# Altium project Audio_Research.PrjPcb (part 3 of 4)

## Sheet Audio_Output_XLR2.SchDoc: Audio Out: Mini XLR 2
size 279 x 215 mm; DrawnBy: Connor Dack; Engineer: Connor Dack; DocumentNumber: 20; Revision: 1.0; SheetNumber: 20; SheetTotal: 20
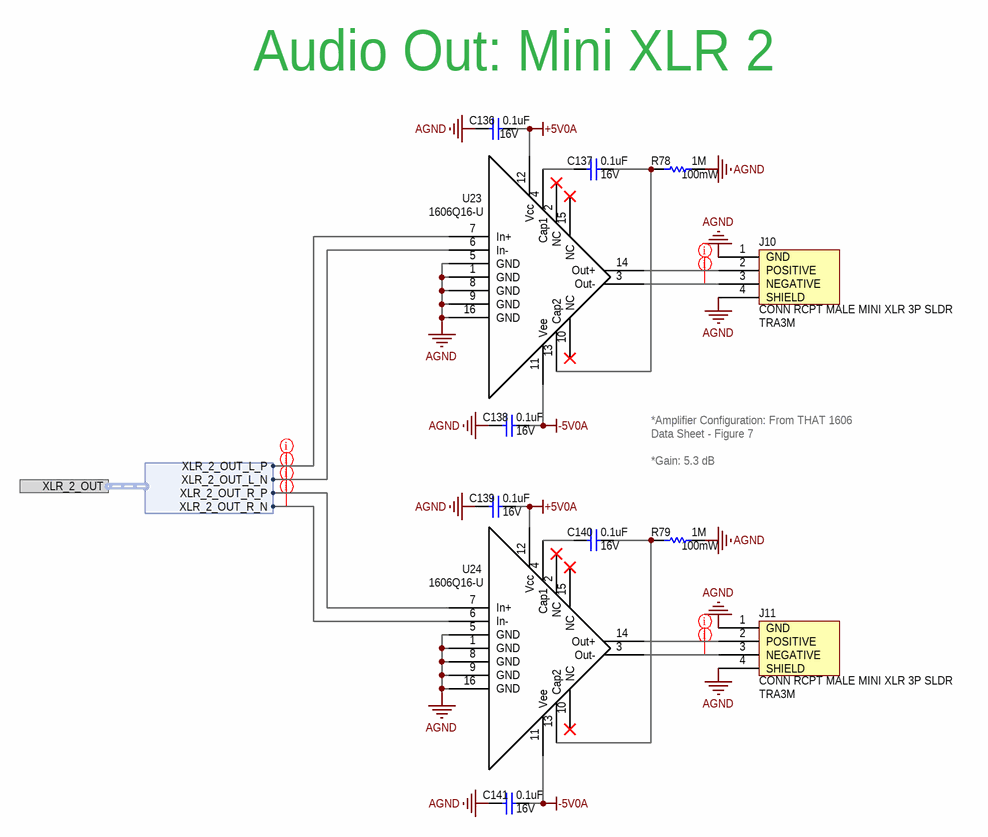
[diagram p8: Audio_Output_XLR2.SchDoc]

### Parts
C136  Voltage Rating: 16V  Capacitance: 0.1uF  [3-0603_L]  (hidden comment: CL10F104ZO8NNNC)
C137  Voltage Rating: 16V  Capacitance: 0.1uF  [3-0603_L]  (hidden comment: CL10F104ZO8NNNC)
C138  Voltage Rating: 16V  Capacitance: 0.1uF  [3-0603_L]  (hidden comment: CL10F104ZO8NNNC)
C139  Voltage Rating: 16V  Capacitance: 0.1uF  [3-0603_L]  (hidden comment: CL10F104ZO8NNNC)
C140  Voltage Rating: 16V  Capacitance: 0.1uF  [3-0603_L]  (hidden comment: CL10F104ZO8NNNC)
C141  Voltage Rating: 16V  Capacitance: 0.1uF  [3-0603_L]  (hidden comment: CL10F104ZO8NNNC)
J10  CONN RCPT MALE MINI XLR 3P SLDR  [TRA3M]
J11  CONN RCPT MALE MINI XLR 3P SLDR  [TRA3M]
R78  Max Power Dissipation: 100mW  Resistance: 1M  [3-0603_R_L]  (hidden comment: RMCF0603FG1M00)
R79  Max Power Dissipation: 100mW  Resistance: 1M  [3-0603_R_L]  (hidden comment: RMCF0603FG1M00)
U23  1606Q16-U  [SOP64P600X175-16N]
U24  1606Q16-U  [SOP64P600X175-16N]

### Ports
XLR_2_OUT (harness XLR_2_OUT)

### Harnesses
XLR_2_OUT: XLR_2_OUT_L_N, XLR_2_OUT_L_P, XLR_2_OUT_R_N, XLR_2_OUT_R_P

### Nets
+5V0A: C136.1 C139.1 U23.12(Vcc) U24.12(Vcc)
-5V0A: C138.1 C141.1 U23.11(Vee) U24.11(Vee)
AGND: C136.2 C138.2 C139.2 C141.2 J10.1(GND) J10.4(SHIELD) J11.1(GND) J11.4(SHIELD) R78.2 R79.2 U23.1(GND) U23.5(GND) U23.8(GND) U23.9(GND) U23.16(GND) U24.1(GND) U24.5(GND) U24.8(GND) U24.9(GND) U24.16(GND)
NetC137_1: C137.1 R78.1 U23.13(Cap2)
NetC137_2: C137.2 U23.4(Cap1)
NetC140_1: C140.1 R79.1 U24.13(Cap2)
NetC140_2: C140.2 U24.4(Cap1)
NetJ10_2: J10.2(POSITIVE) U23.14(Out+)
NetJ10_3: J10.3(NEGATIVE) U23.3(Out-)
NetJ11_2: J11.2(POSITIVE) U24.14(Out+)
NetJ11_3: J11.3(NEGATIVE) U24.3(Out-)
NetU1_10: U23.7(In+) ; port XLR_2_OUT.XLR_2_OUT_L_P
NetU1_11: U23.6(In-) ; port XLR_2_OUT.XLR_2_OUT_L_N
NetU1_12: U24.7(In+) ; port XLR_2_OUT.XLR_2_OUT_R_P
NetU1_13: U24.6(In-) ; port XLR_2_OUT.XLR_2_OUT_R_N

Not connected (* = marked no-connect by the designer): U23 2(NC)* 10(NC)* 15(NC)*; U24 2(NC)* 10(NC)* 15(NC)*

### Layout directives
net class XLR_2_Out: NetU1_10, NetU1_11, NetU1_12, NetU1_13
net class XLR_2_Out_Conn: NetJ10_2, NetJ10_3, NetJ11_2, NetJ11_3

### Notes on the sheet
- (near C136) Audio Out: Mini XLR 2
- *Amplifier Configuration: From THAT 1606 Data Sheet - Figure 7
  *Gain: 5.3 dB
- Title:
- Sheet:
- of
- Size:
- 11 x 8.5 Inches
- Rev:
- Date:
- Engineer:
- Time:
- File:
- Copyright 2020 Audio Logic Inc
  THE HARDWARE IS PROVIDED "AS IS", WITHOUT WARRANTY OF ANY KIND, EXPRESS OR IMPLIED, INCLUDING BUT NOT LIMITED TO THE WARRANTIES OF MERCHANTABILITY, FITNESS FOR A PARTICULAR PURPOSE AND NONINFRINGEMENT. IN NO EVENT SHALL THE AUTHORS OR COPYRIGHT HOLDERS BE LIABLE FOR ANY CLAIM, DAMAGES OR OTHER LIABILITY, WHETHER IN AN ACTION OF CONTRACT, TORT OR OTHERWISE, ARISING FROM, OUT OF OR IN CONNECTION WITH THE HARDWARE OR THE USE OR OTHER DEALINGS IN THE HARDWARE.

### Library data of the parts
C136-C141 = CL10F104ZO8NNNC: as C3 on sheet Audio_Codec; Supplier 1: Digi-Key; Stock 1: 40000; Pricing 1: 1=0.1, 10=0.038, 100=0.0169, 500=0.01208, 1000=0.00949 (USD); Mount: Surface Mount; Case/Package: 0603; Case Code (Metric): 1608; Case Code (Imperial): 0603; Min Operating Temperature: -30°C; Max Operating Temperature: 85°C; Package Quantity: 1; Packaging: Tape and Reel; Dielectric: Y5V; Length: 1.6mm; Height: 0.8mm; Width: 0.031inch; Thickness: 0.035inch; Depth: 0.8mm; Radiation Hardening: No; ComponentLink1URL: https://datasheet.ciiva.com/25805/cl10f104zo8nnnc-25805810.pdf; ComponentLink1Description: https://datasheet.ciiva.com/25805/cl10f104zo8nnnc-25805810.pdf; ComponentLink2URL: https://datasheet.ciiva.com/16199/cl10f104zo8nnnc-16199254.pdf; ComponentLink2Description: https://datasheet.ciiva.com/16199/cl10f104zo8nnnc-16199254.pdf; Supplier Part Number 1: 1276-1258-6-ND; Manufacturer Part Number: CL10F104ZO8NNNC
J10 J11 = TRA3M: 3 Position Circular Connector Receptacle, Male Pins Solder Silver; Manufacturer: Switchcraft; Body Material: Metal,Copper Alloy; Max Current Rating: 5A; Max Voltage Rating (AC): 125V; Voltage Rating: 250V; Connector Type: Receptacle,Pin; Number of Positions: 3; Number of Ports: 1; Wire/Cable Gauge: 28AWG; Supplier 1: Digi-Key; Stock 1: 295; Pricing 1: 1=12.74, 10=9.754, 25=9.5096, 50=8.7782, 100=8.2906, 250=7.9248 (USD); Mount: Through Hole,Panel,Bulkhead,PCB; Case/Package: Metal; Contact Material: Brass,Copper Alloy; Contact Plating: Nickel,Tin,Silver; Colour: Black; Number of Terminals: 3; Housing Material: Copper Alloy; Insulation Material: Thermoplastic; Min Operating Temperature: -55°C; Max Operating Temperature: 85°C; Package Quantity: 1; Current Rating: 5A; Fastening Type: Threaded; Packaging: Bulk; Gender: Male; Termination: Solder; Number of Contacts: 3; Orientation: Right Angle; Length: 15.49mm; Height: 15.24mm; Depth: 26.92mm; REACH SVHC: No SVHC; Lead Free: Lead Free; ComponentLink1URL: https://datasheet.ciiva.com/7327/tra3m-series-cd-7327368.pdf; ComponentLink1Description: https://datasheet.ciiva.com/7327/tra3m-series-cd-7327368.pdf; ComponentLink2URL: https://datasheet.ciiva.com/16879/70214235-16879259.pdf; ComponentLink2Description: https://datasheet.ciiva.com/16879/70214235-16879259.pdf; ComponentLink3URL: https://datasheet.ciiva.com/8053/28686-8053836.pdf; ComponentLink3Description: https://datasheet.ciiva.com/8053/28686-8053836.pdf; Supplier Part Number 1: SC1550-ND; Manufacturer Part Number: TRA3M
R78 R79 = RMCF0603FG1M00: RES 1M OHM 1% 1/10W 0603; Manufacturer: Stackpole Electronics; Temperature Coefficient: 100ppm/°C; Supplier 1: Digi-Key; Manufacturer Part Number: RMCF0603FG1M00; Stock 1: 129722; Pricing 1: 1=0.1, 10=0.017, 100=0.0069, 1000=0.00309, 2500=0.00268, 5000=0.00222 (USD); Mount: Surface Mount; Case/Package: 0603; Case Code (Metric): 1608; Case Code (Imperial): 0603; Contact Plating: Tin,Matte; Min Operating Temperature: -55°C; Max Operating Temperature: 155°C; Package Quantity: 1; Packaging: Tape and Reel; Tolerance: 1%; Composition: Thick Film; Number of Terminations: 2; Length: 0.061inch; Height: 0.022inch; Width: 0.031inch; Radiation Hardening: No; Lead Free: Contains Lead; ComponentLink1URL: https://www.seielect.com/Catalog/SEI-RMCF_RMCP.pdf; ComponentLink1Description: https://www.seielect.com/Catalog/SEI-RMCF_RMCP.pdf; ComponentLink2URL: https://www.seielect.com/catalog/SEI-Packaging.pdf; ComponentLink2Description: https://www.seielect.com/catalog/SEI-Packaging.pdf; Supplier Part Number 1: RMCF0603FG1M00CT-ND
U23 U24 = 1606Q16-U: Audio Amplifiers Balanced Audio Line Driver IC; Manufacturer: THAT; Max Supply Voltage: 18V; Min Supply Voltage: 4V; Nominal Supply Current: 4.9mA; Supplier 1: Mouser; Stock 1: 3475; Pricing 1: 1=4.65, 10=4.65, 50=3.91, 100=3.35, 1000=2.79, 10000=2.6 (USD); Case/Package: QSOP; Min Operating Temperature: -40°C; Max Operating Temperature: 85°C; Package Quantity: 98; Packaging: Rail/Tube; ComponentLink1URL: http://www.mouser.com/ds/2/407/1600data-6754.pdf; ComponentLink1Description: http://www.mouser.com/ds/2/407/1600data-6754.pdf; Supplier Part Number 1: 887-1606Q16-U; Manufacturer Part Number: 1606Q16-U

## Sheet Audio_Input_Mic_In.SchDoc: Audio Input: Microphone In
size 279 x 215 mm; DrawnBy: Connor Dack; Engineer: Connor Dack; DocumentNumber: 13; Revision: 1.0; SheetNumber: 13; SheetTotal: 20
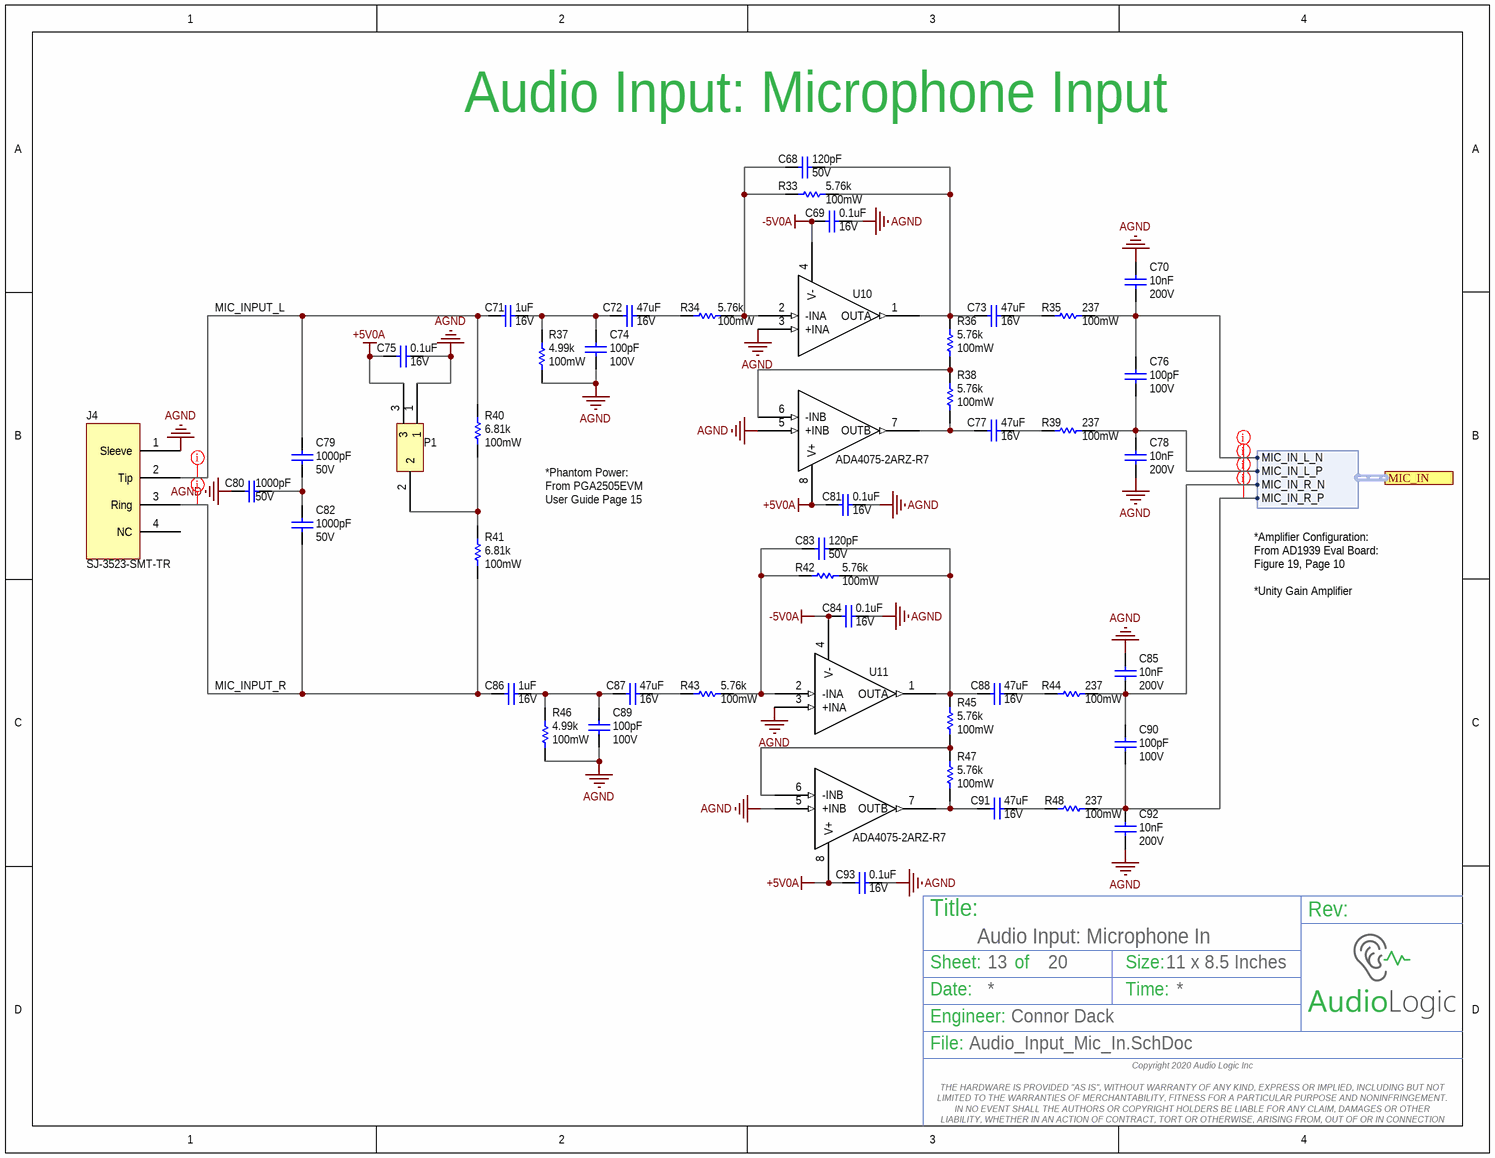
[diagram p9: Audio_Input_Mic_In.SchDoc]

### Parts
C68  Voltage - Rated: 50V  Capacitance: 120pF  [3-0603_L]  (hidden comment: CL10C121JB8NCNC)
C69  Voltage Rating: 16V  Capacitance: 0.1uF  [3-0603_L]  (hidden comment: CL10F104ZO8NNNC)
C70  Voltage Rating: 200V  Capacitance: 10nF  [3-0603_L]
C71  Voltage Rating: 16V  Capacitance: 1uF  [3-0603_L]  (hidden comment: CGA3E1X7R1C105M080AC)
C72  Voltage Rating: 16V  Capacitance: 47uF  [C1210X25_L]  (hidden comment: CL32A476KOJNNNE)
C73  Voltage Rating: 16V  Capacitance: 47uF  [C1210X25_L]  (hidden comment: CL32A476KOJNNNE)
C74  Voltage - Rated: 100V  Capacitance: 100pF  [3-0603_L]  (hidden comment: C1608C0G2A101J)
C75  Voltage Rating: 16V  Capacitance: 0.1uF  [3-0603_L]  (hidden comment: CL10F104ZO8NNNC)
C76  Voltage - Rated: 100V  Capacitance: 100pF  [3-0603_L]  (hidden comment: C1608C0G2A101J)
C77  Voltage Rating: 16V  Capacitance: 47uF  [C1210X25_L]  (hidden comment: CL32A476KOJNNNE)
C78  Voltage Rating: 200V  Capacitance: 10nF  [3-0603_L]
C79  Voltage - Rated: 50V  Capacitance: 1000pF  [3-0603_L]  (hidden comment: CL10B102KB8NNNC)
C80  Voltage - Rated: 50V  Capacitance: 1000pF  [3-0603_L]  (hidden comment: CL10B102KB8NNNC)
C81  Voltage Rating: 16V  Capacitance: 0.1uF  [3-0603_L]  (hidden comment: CL10F104ZO8NNNC)
C82  Voltage - Rated: 50V  Capacitance: 1000pF  [3-0603_L]  (hidden comment: CL10B102KB8NNNC)
C83  Voltage - Rated: 50V  Capacitance: 120pF  [3-0603_L]  (hidden comment: CL10C121JB8NCNC)
C84  Voltage Rating: 16V  Capacitance: 0.1uF  [3-0603_L]  (hidden comment: CL10F104ZO8NNNC)
C85  Voltage Rating (DC): 200V  Capacitance: 10nF  [3-0603_L]
C86  Voltage Rating: 16V  Capacitance: 1uF  [3-0603_L]  (hidden comment: CGA3E1X7R1C105M080AC)
C87  Voltage Rating: 16V  Capacitance: 47uF  [C1210X25_L]  (hidden comment: CL32A476KOJNNNE)
C88  Voltage Rating: 16V  Capacitance: 47uF  [C1210X25_L]  (hidden comment: CL32A476KOJNNNE)
C89  Voltage - Rated: 100V  Capacitance: 100pF  [3-0603_L]  (hidden comment: C1608C0G2A101J)
C90  Voltage - Rated: 100V  Capacitance: 100pF  [3-0603_L]  (hidden comment: C1608C0G2A101J)
C91  Voltage Rating: 16V  Capacitance: 47uF  [C1210X25_L]  (hidden comment: CL32A476KOJNNNE)
C92  Voltage Rating: 200V  Capacitance: 10nF  [3-0603_L]
C93  Voltage Rating: 16V  Capacitance: 0.1uF  [3-0603_L]  (hidden comment: CL10F104ZO8NNNC)
J4  SJ-3523-SMT-TR  [SJ-3523-SMT-TR]
P1  3PIN_Connector  [3Pin_Header]  (value not drawn)
R33  Power (Watts): 100mW  Resistance (Ohms): 5.76k  [3-0603_R_L]  (hidden comment: ERJ-3EKF5761V)
R34  Power (Watts): 100mW  Resistance (Ohms): 5.76k  [3-0603_R_L]  (hidden comment: ERJ-3EKF5761V)
R35  Power (Watts): 100mW  Resistance (Ohms): 237  [3-0603_R_L]  (hidden comment: ERJ-3EKF2370V)
R36  Power (Watts): 100mW  Resistance (Ohms): 5.76k  [3-0603_R_L]  (hidden comment: ERJ-3EKF5761V)
R37  Power (Watts): 100mW  Resistance (Ohms): 4.99k  [3-0603_R_L]  (hidden comment: ERJ-3EKF4991V)
R38  Power (Watts): 100mW  Resistance (Ohms): 5.76k  [3-0603_R_L]  (hidden comment: ERJ-3EKF5761V)
R39  Power (Watts): 100mW  Resistance (Ohms): 237  [3-0603_R_L]  (hidden comment: ERJ-3EKF2370V)
R40  Power Rating: 100mW  Resistance: 6.81k  [3-0603_R_L]  (hidden comment: ERJ-3EKF6811V)
R41  Power Rating: 100mW  Resistance: 6.81k  [3-0603_R_L]  (hidden comment: ERJ-3EKF6811V)
R42  Power (Watts): 100mW  Resistance (Ohms): 5.76k  [3-0603_R_L]  (hidden comment: ERJ-3EKF5761V)
R43  Power (Watts): 100mW  Resistance (Ohms): 5.76k  [3-0603_R_L]  (hidden comment: ERJ-3EKF5761V)
R44  Power (Watts): 100mW  Resistance (Ohms): 237  [3-0603_R_L]  (hidden comment: ERJ-3EKF2370V)
R45  Power (Watts): 100mW  Resistance (Ohms): 5.76k  [3-0603_R_L]  (hidden comment: ERJ-3EKF5761V)
R46  Power (Watts): 100mW  Resistance (Ohms): 4.99k  [3-0603_R_L]  (hidden comment: ERJ-3EKF4991V)
R47  Power (Watts): 100mW  Resistance (Ohms): 5.76k  [3-0603_R_L]  (hidden comment: ERJ-3EKF5761V)
R48  Power (Watts): 100mW  Resistance (Ohms): 237  [3-0603_R_L]  (hidden comment: ERJ-3EKF2370V)
U10  ADA4075-2ARZ-R7  [SOIC127P600X175-8L]
U11  ADA4075-2ARZ-R7  [SOIC127P600X175-8L]

### Ports
MIC_IN (harness MIC_IN)

### Harnesses
MIC_IN: MIC_IN_R_P, MIC_IN_R_N, MIC_IN_L_N, MIC_IN_L_P

### Nets
+5V0A: C75.2 C81.2 C93.2 P1.3 U10.8(V+) U11.8(V+)
-5V0A: C69.2 C84.2 U10.4(V-) U11.4(V-)
AGND: C69.1 C70.2 C74.2 C75.1 C78.1 C80.2 C81.1 C84.1 C85.2 C89.2 C92.1 C93.1 J4.1(Sleeve) P1.1 R37.1 R46.1 U10.3(+INA) U10.5(+INB) U11.3(+INA) U11.5(+INB)
MIC_INPUT_L: C71.1 C79.2 J4.2(Tip) R40.2
MIC_INPUT_R: C82.1 C86.1 J4.3(Ring) R41.1
NetC68_1: C68.1 R33.1 R34.2 U10.2(-INA)
NetC68_2: C68.2 C73.1 R33.2 R36.1 U10.1(OUTA)
NetC70_1: C70.1 C76.2 R35.2 ; port MIC_IN.MIC_IN_L_N
NetC71_2: C71.2 C72.1 C74.1 R37.2
NetC72_2: C72.2 R34.1
NetC73_2: C73.2 R35.1
NetC76_1: C76.1 C78.2 R39.2 ; port MIC_IN.MIC_IN_L_P
NetC77_1: C77.1 R38.2 U10.7(OUTB)
NetC77_2: C77.2 R39.1
NetC79_1: C79.1 C80.1 C82.2
NetC83_1: C83.1 R42.1 R43.2 U11.2(-INA)
NetC83_2: C83.2 C88.1 R42.2 R45.1 U11.1(OUTA)
NetC85_1: C85.1 C90.2 R44.2 ; port MIC_IN.MIC_IN_R_N
NetC86_2: C86.2 C87.1 C89.1 R46.2
NetC87_2: C87.2 R43.1
NetC88_2: C88.2 R44.1
NetC90_1: C90.1 C92.2 R48.2 ; port MIC_IN.MIC_IN_R_P
NetC91_1: C91.1 R47.2 U11.7(OUTB)
NetC91_2: C91.2 R48.1
NetP1_2: P1.2 R40.1 R41.2
NetR36_2: R36.2 R38.1 U10.6(-INB)
NetR45_2: R45.2 R47.1 U11.6(-INB)

Not connected (* = marked no-connect by the designer): J4 4(NC)

### Layout directives
net class Mic_In: NetC70_1, NetC76_1, NetC85_1, NetC90_1
net class Mic_In_3.5mm: MIC_INPUT_L, MIC_INPUT_R

### Notes on the sheet
- (near C68) Audio Input: Microphone Input
- *Phantom Power: From PGA2505EVM User Guide Page 15
- *Amplifier Configuration: From AD1939 Eval Board: Figure 19, Page 10
  *Unity Gain Amplifier
- Title:
- Sheet:
- of
- Size:
- 11 x 8.5 Inches
- Rev:
- Date:
- Engineer:
- Time:
- File:
- Copyright 2020 Audio Logic Inc
  THE HARDWARE IS PROVIDED "AS IS", WITHOUT WARRANTY OF ANY KIND, EXPRESS OR IMPLIED, INCLUDING BUT NOT LIMITED TO THE WARRANTIES OF MERCHANTABILITY, FITNESS FOR A PARTICULAR PURPOSE AND NONINFRINGEMENT. IN NO EVENT SHALL THE AUTHORS OR COPYRIGHT HOLDERS BE LIABLE FOR ANY CLAIM, DAMAGES OR OTHER LIABILITY, WHETHER IN AN ACTION OF CONTRACT, TORT OR OTHERWISE, ARISING FROM, OUT OF OR IN CONNECTION WITH THE HARDWARE OR THE USE OR OTHER DEALINGS IN THE HARDWARE.

### Library data of the parts
C68 C83 = CL10C121JB8NCNC: 120pF 50V Ceramic Capacitor C0G, NP0 0603 (1608 Metric) 0.063" L x 0.031" W (1.60mm x 0.80mm); Manufacturer: Samsung Electro-Mechanics America, Inc.; Tolerance: ±5%; Supplier 1: Digi-Key; Manufacturer Part Number: CL10C121JB8NCNC; RoHS: RoHS Compliant; Category: Capacitors; Stock 1: 26285; Pricing 1: 1=0.1, 10=0.03, 25=0.0208, 50=0.016, 100=0.0135, 500=0.00948, 1000=0.00738 (USD); Packaging: Cut Tape (CT); Part Status: Active; Temperature Coefficient: C0G, NP0; Mounting Type: Surface Mount, MLCC; Operating Temperature: -55°C ~ 125°C; Applications: General Purpose; Ratings: -; Package / Case: 0603 (1608 Metric); Size / Dimension: 0.063" L x 0.031" W (1.60mm x 0.80mm); Height - Seated (Max): -; Thickness (Max): 0.035" (0.90mm); Lead Spacing: -; Features: -; Lead Style: -; ComponentLink1URL: http://media.digikey.com/pdf/Data%20Sheets/Samsung%20PDFs/CL10C121JB8NCNC_Spec.pdf; ComponentLink1Description: http://media.digikey.com/pdf/Data%20Sheets/Samsung%20PDFs/CL10C121JB8NCNC_Spec.pdf; Supplier Part Number 1: 1276-2180-1-ND; Load Status: *
C69 C75 C81 C84 C93 = CL10F104ZO8NNNC: CAP CER 0.1UF 16V Y5V 0603; Manufacturer: Samsung; Tolerance: 80%; Supplier 1: Digi-Key; Stock 1: 40000; Pricing 1: 1=0.1, 10=0.038, 100=0.0169, 500=0.01208, 1000=0.00949 (USD); Mount: Surface Mount; Case/Package: 0603; Case Code (Metric): 1608; Case Code (Imperial): 0603; Min Operating Temperature: -30°C; Max Operating Temperature: 85°C; Package Quantity: 1; Packaging: Tape and Reel; Dielectric: Y5V; Length: 1.6mm; Height: 0.8mm; Width: 0.031inch; Thickness: 0.035inch; Depth: 0.8mm; Radiation Hardening: No; ComponentLink1URL: https://datasheet.ciiva.com/25805/cl10f104zo8nnnc-25805810.pdf; ComponentLink1Description: https://datasheet.ciiva.com/25805/cl10f104zo8nnnc-25805810.pdf; ComponentLink2URL: https://datasheet.ciiva.com/16199/cl10f104zo8nnnc-16199254.pdf; ComponentLink2Description: https://datasheet.ciiva.com/16199/cl10f104zo8nnnc-16199254.pdf; Supplier Part Number 1: 1276-1258-6-ND; Manufacturer Part Number: CL10F104ZO8NNNC
C70 C78 C85 C92 = C1608C0G1H050C080AA: CAP CER 10000PF 200V X7R 0603; Manufacturer: KEMET; Dielectric Material: Ceramic; Tolerance: 5%; Supplier 1: Digi-Key; Manufacturer Part Number: C0603C103J2RACTU; Stock 1: 2052; Pricing 1: 1=0.57, 10=0.392, 100=0.2355, 500=0.1766, 1000=0.14913 (USD); Mount: Surface Mount; Case/Package: 0603; Case Code (Metric): 1608; Case Code (Imperial): 0603; Min Operating Temperature: -55°C; Max Operating Temperature: 125°C; Package Quantity: 1; Packaging: Tape and Reel; Dielectric: X7R; Termination: SMD/SMT; Length: 1.6mm; Height: 0.8mm; Width: 0.031inch; Thickness: 0.034inch; ComponentLink1URL: https://search.kemet.com/component-edge/download/datasheet/C0603C103J2RACTU.pdf; ComponentLink1Description: https://search.kemet.com/component-edge/download/datasheet/C0603C103J2RACTU.pdf; ComponentLink2URL: http://www.kemet.com/Lists/ProductCatalog/Attachments/53/KEM_C1002_X7R_SMD.pdf; ComponentLink2Description: http://www.kemet.com/Lists/ProductCatalog/Attachments/53/KEM_C1002_X7R_SMD.pdf; Supplier Part Number 1: 399-10040-6-ND
  C70 C78 C92: Voltage Rating (DC): 200V
  C85: Voltage Rating: 200V
C71 C86 = CGA3E1X7R1C105M080AC: CAP CER 1UF 16V X7R 0603; Manufacturer: TDK; Tolerance: 20%; Supplier 1: Digi-Key; Manufacturer Part Number: CGA3E1X7R1C105M080AC; Stock 1: 18034; Pricing 1: 1=0.14, 10=0.1, 100=0.0468, 500=0.0328, 1000=0.0272 (USD); Mount: Surface Mount; Case/Package: 0603; Weight: 7.1E-05oz; Case Code (Metric): 1608; Case Code (Imperial): 0603; Min Operating Temperature: -55°C; Max Operating Temperature: 125°C; Package Quantity: 4000; Packaging: Tape and Reel; Dielectric: X7R; Termination: SMD/SMT; Voltage Rating (DC): 16V; Length: 0.063inch; Height: 0.8mm; Width: 0.031inch; Thickness: 0.035inch; Lead Free: Lead Free; ComponentLink1URL: https://product.tdk.com/info/en/catalog/datasheets/mlcc_automotive_general_en.pdf; ComponentLink1Description: https://product.tdk.com/info/en/catalog/datasheets/mlcc_automotive_general_en.pdf; ComponentLink2URL: http://product.tdk.com/capacitor/mlcc/detailed_information.php?lang=en&ref=jp&part_no=CGA3E1X7R1C105M080AC; ComponentLink2Description: http://product.tdk.com/capacitor/mlcc/detailed_information.php?lang=en&ref=jp&part_no=CGA3E1X7R1C105M080AC; ComponentLink3URL: http://product.tdk.com/en/catalog/datasheets/mlcc_automotive_general_en.pdf; ComponentLink3Description: http://product.tdk.com/en/catalog/datasheets/mlcc_automotive_general_en.pdf; Supplier Part Number 1: 445-12540-6-ND
C72 C73 C77 C87 C88 C91 = CL32A476KOJNNNE: CAP CER 47UF 16V X5R 1210; Manufacturer: Samsung; Tolerance: 10%; Supplier 1: Digi-Key; Manufacturer Part Number: CL32A476KOJNNNE; Stock 1: 10000; Pricing 1: 1=1.12, 10=0.853, 100=0.6104, 500=0.47254 (USD); Mount: Surface Mount; Case/Package: 1210; Case Code (Metric): 3225; Case Code (Imperial): 1210; Min Operating Temperature: -55°C; Max Operating Temperature: 85°C; Package Quantity: 1; Packaging: Tape and Reel; Dielectric: X5R; Voltage Rating (DC): 16V; Length: 0.126inch; Width: 0.098inch; Thickness: 0.106inch; Lead Free: Lead Free; ComponentLink1URL: https://datasheet.ciiva.com/25785/cl32a476kojnnne-25785873.pdf; ComponentLink1Description: https://datasheet.ciiva.com/25785/cl32a476kojnnne-25785873.pdf; Supplier Part Number 1: 1276-3376-6-ND
C74 C76 C89 C90 = C1608C0G2A101J: CAP CER 100PF 100V 5% NP0 0603; Manufacturer: TDK Corporation; Temperature Coefficient: C0G, NP0; Supplier 1: Digi-Key; Manufacturer Part Number: C1608C0G2A101J; RoHS: RoHS Compliant; Category: Capacitors; Stock 1: 128588; Pricing 1: 10=0.05, 100=0.0231, 250=0.01892, 500=0.01618, 1000=0.0126 (USD); Tolerance: ±5%; Mounting Type: Surface Mount, MLCC; Operating Temperature: -55°C ~ 125°C; Applications: General Purpose; Ratings: -; Package / Case: 0603 (1608 Metric); Size / Dimension: 0.063" L x 0.031" W (1.60mm x 0.80mm); Height - Seated (Max): -; Thickness (Max): 0.037" (0.95mm); Lead Spacing: -; Features: -; Packaging: Cut Tape (CT); Lead Style: -; ComponentLink1URL: http://www.tdk.com/pdf/mid_volt_B11.pdf; ComponentLink1Description: http://www.tdk.com/pdf/mid_volt_B11.pdf; Supplier Part Number 1: 445-2306-1-ND
  C76 C90: Load Status: *
C79 C80 C82 = CL10B102KB8NNNC: 1000pF 50V Ceramic Capacitor X7R 0603 (1608 Metric) 0.063" L x 0.031" W (1.60mm x 0.80mm); Manufacturer: Samsung Electro-Mechanics America, Inc.; Tolerance: ±10%; Supplier 1: Digi-Key; Manufacturer Part Number: CL10B102KB8NNNC; RoHS: RoHS Compliant; Category: Capacitors; Stock 1: 294007; Pricing 1: 1=0.1, 10=0.017, 25=0.012, 50=0.0092, 100=0.0077, 500=0.0054, 1000=0.0042 (USD); Packaging: Cut Tape (CT); Part Status: Active; Temperature Coefficient: X7R; Mounting Type: Surface Mount, MLCC; Operating Temperature: -55°C ~ 125°C; Applications: General Purpose; Ratings: -; Package / Case: 0603 (1608 Metric); Size / Dimension: 0.063" L x 0.031" W (1.60mm x 0.80mm); Height - Seated (Max): -; Thickness (Max): 0.035" (0.90mm); Lead Spacing: -; Features: -; Lead Style: -; ComponentLink1URL: http://www.samsungsem.com/kr/support/product-search/mlcc/__icsFiles/afieldfile/2015/06/15/CL10B102KB8NNNC.pdf; ComponentLink1Description: http://www.samsungsem.com/kr/support/product-search/mlcc/__icsFiles/afieldfile/2015/06/15/CL10B102KB8NNNC.pdf; Supplier Part Number 1: 1276-1018-1-ND; Load Status: *
J4 = SJ-3523-SMT-TR: 3.50mm (0.141", 1/8", Mini Plug) - Headphone Phone Jack Stereo Connector Solder; Manufacturer: CUI Inc.; Gender: Female; Actual Diameter: 0.142" (3.60mm); Number of Positions/Contacts: 3 Conductors, 3 Contacts; Internal Switch(s): Does Not Contain Switch; Shielding: Unshielded; Voltage - Rated: 12VDC; Current Rating: 1A; Mating Length/Depth: 0.551" (14.00mm); Body Color: Black; Includes: 1 pc - 1 Connector; Notes: FE Provides: 23; LatestRevisionDate: 17-Jul-2002; LatestRevisionNote: Re-released for DXP Platform.; Publisher: Altium Limited; Supplier 1: Digi-Key; RoHS: RoHS Compliant; Category: Connectors, Interconnects; Stock 1: 104981; Pricing 1: 1=1.34, 10=1.043, 100=0.7961, 500=0.63558 (USD); Packaging: Cut Tape (CT); Part Status: Active; Connector Type: Phone Jack; Signal Lines: Stereo; Industry Recognized Mating Diameter: 3.50mm (0.141", 1/8", Mini Plug) - Headphone; Mounting Type: Surface Mount, Right Angle; Termination: Solder; Features: Board Guide; Insulation Color: -; Contact Material - Plating: Silver; Body Material: -; ComponentLink1URL: http://www.cui.com/product/resource/digikeypdf/sj-352x-smt_series.pdf; ComponentLink1Description: http://www.cui.com/product/resource/digikeypdf/sj-352x-smt_series.pdf; Supplier Part Number 1: CP-3523SJCT-ND; Manufacturer Part Number: SJ-3523-SMT-TR
P1 = CONN_TH_3PIN_0D1: 3 Pin Through Hole Connector with 0.1" Spacing; Manufacturer: Samtec; Manufacturer Part Number: TSW-103-07-G-S; LatestRevisionDate: 17-Jul-2002; LatestRevisionNote: Re-released for DXP Platform.; Publisher: Altium Limited; Supplier 1: Samtec; Supplier Part Number 1: TSW-103-07-G-S
R33 R34 R36 R38 R42 R43 R45 R47 = ERJ-3EKF5761V: RES SMD 5.76K OHM 1% 1/10W 0603; Manufacturer: Panasonic Electronic Components; Temperature Coefficient: ±100ppm/°C; Supplier 1: Digi-Key; Manufacturer Part Number: ERJ-3EKF5761V; RoHS: RoHS Compliant; Category: Resistors; Stock 1: 90842; Pricing 1: 1=0.1, 50=0.0114, 100=0.0084, 250=0.00644, 500=0.00514, 1000=0.00379 (USD); Packaging: Cut Tape (CT); Part Status: Active; Tolerance: ±1%; Composition: Thick Film; Features: Automotive AEC-Q200; Operating Temperature: -55°C ~ 155°C; Package / Case: 0603 (1608 Metric); Supplier Device Package: 0603; Size / Dimension: 0.063" L x 0.031" W (1.60mm x 0.80mm); Height: 0.022" (0.55mm); Number of Terminations: 2; ComponentLink1URL: http://industrial.panasonic.com/www-cgi/jvcr13pz.cgi?E+PZ+3+AOA0002+ERJ3EKF5761V+7+WW; ComponentLink1Description: http://industrial.panasonic.com/www-cgi/jvcr13pz.cgi?E+PZ+3+AOA0002+ERJ3EKF5761V+7+WW; Supplier Part Number 1: P5.76KHCT-ND; Load Status: *
R35 R39 R44 R48 = ERJ-3EKF2370V: RES SMD 237 OHM 1% 1/10W 0603; Manufacturer: Panasonic Electronic Components; Temperature Coefficient: ±100ppm/°C; Supplier 1: Digi-Key; Manufacturer Part Number: ERJ-3EKF2370V; RoHS: RoHS Compliant; Category: Resistors; Stock 1: 74413; Pricing 1: 1=0.1, 50=0.0114, 100=0.0084, 250=0.00644, 500=0.00514, 1000=0.00379 (USD); Packaging: Cut Tape (CT); Part Status: Active; Tolerance: ±1%; Composition: Thick Film; Features: Automotive AEC-Q200; Operating Temperature: -55°C ~ 155°C; Package / Case: 0603 (1608 Metric); Supplier Device Package: 0603; Size / Dimension: 0.063" L x 0.031" W (1.60mm x 0.80mm); Height: 0.022" (0.55mm); Number of Terminations: 2; ComponentLink1URL: http://industrial.panasonic.com/www-cgi/jvcr13pz.cgi?E+PZ+3+AOA0002+ERJ3EKF2370V+7+WW; ComponentLink1Description: http://industrial.panasonic.com/www-cgi/jvcr13pz.cgi?E+PZ+3+AOA0002+ERJ3EKF2370V+7+WW; Supplier Part Number 1: P237HCT-ND; Load Status: *
R37 R46 = ERJ-3EKF4991V: RES SMD 4.99K OHM 1% 1/10W 0603; Manufacturer: Panasonic Electronic Components; Temperature Coefficient: ±100ppm/°C; Supplier 1: Digi-Key; Manufacturer Part Number: ERJ-3EKF4991V; RoHS: RoHS Compliant; Category: Resistors; Stock 1: 870970; Pricing 1: 1=0.1, 50=0.0114, 100=0.0084, 250=0.00644, 500=0.00514, 1000=0.00379 (USD); Packaging: Cut Tape (CT); Part Status: Active; Tolerance: ±1%; Composition: Thick Film; Features: Automotive AEC-Q200; Operating Temperature: -55°C ~ 155°C; Package / Case: 0603 (1608 Metric); Supplier Device Package: 0603; Size / Dimension: 0.063" L x 0.031" W (1.60mm x 0.80mm); Height: 0.022" (0.55mm); Number of Terminations: 2; ComponentLink1URL: http://industrial.panasonic.com/www-cgi/jvcr13pz.cgi?E+PZ+3+AOA0002+ERJ3EKF4991V+7+WW; ComponentLink1Description: http://industrial.panasonic.com/www-cgi/jvcr13pz.cgi?E+PZ+3+AOA0002+ERJ3EKF4991V+7+WW; Supplier Part Number 1: P4.99KHCT-ND
R40 R41 = ERJ-3EKF6811V: RES SMD 6.81K OHM 1% 1/10W 0603; Manufacturer: Panasonic ECG; Voltage Rating: 75V; Temperature Coefficient: 100ppm/°C; Voltage Rating (DC): 50V; Stock 1: 326226; Pricing 1: 1=0.1, 10=0.063, 100=0.0257, 1000=0.0115, 2500=0.01 (USD); Mount: Surface Mount; Case/Package: 0603; Case Code (Imperial): 0603; Case Code (Metric): 1608; Contact Plating: Tin; Min Operating Temperature: -55°C; Max Operating Temperature: 155°C; Tolerance: 1%; Packaging: Tape and Reel; Package Quantity: 1; Composition: Thick Film; Number of Terminations: 2; Termination: SMD/SMT; Military Standard: Not; Max Power Dissipation: 100mW; Length: 1.6mm; Height: 0.45mm; Width: 0.8mm; Depth: 0.8mm; Radiation Hardening: No; REACH SVHC: Unknown; Lead Free: Lead Free; ComponentLink1URL: https://datasheet.ciiva.com/9117/aoa0000ce2-9117125.pdf; ComponentLink1Description: https://datasheet.ciiva.com/9117/aoa0000ce2-9117125.pdf; ComponentLink2URL: https://datasheet.ciiva.com/46389/426256-46389990.pdf; ComponentLink2Description: https://datasheet.ciiva.com/46389/426256-46389990.pdf; ComponentLink3URL: https://datasheet.ciiva.com/24027/aoa0000ce2-24027336.pdf; ComponentLink3Description: https://datasheet.ciiva.com/24027/aoa0000ce2-24027336.pdf; ComponentLink4URL: https://datasheet.ciiva.com/28693/1678782-28693560.pdf; ComponentLink4Description: https://datasheet.ciiva.com/28693/1678782-28693560.pdf; ComponentLink5URL: https://datasheet.ciiva.com/5969/426256-5969386.pdf; ComponentLink5Description: https://datasheet.ciiva.com/5969/426256-5969386.pdf; ComponentLink6URL: https://datasheet.ciiva.com/16440/aoa0000ce2-16440170.pdf; ComponentLink6Description: https://datasheet.ciiva.com/16440/aoa0000ce2-16440170.pdf; ComponentLink7URL: https://datasheet.ciiva.com/48531/aoa0000ce2-48531934.pdf; ComponentLink7Description: https://datasheet.ciiva.com/48531/aoa0000ce2-48531934.pdf; ComponentLink8URL: https://datasheet.ciiva.com/16759/70260748-16759487.pdf; ComponentLink8Description: https://datasheet.ciiva.com/16759/70260748-16759487.pdf; ComponentLink9URL: https://datasheet.ciiva.com/43460/426256-43460527.pdf; ComponentLink9Description: https://datasheet.ciiva.com/43460/426256-43460527.pdf; Supplier Part Number 1: P6.81KHDKR-ND; Supplier 1: Digi-Key; Manufacturer Part Number: ERJ-3EKF6811V
U10 U11 = ADA4075-2ARZ-R7: IC OPAMP GP 6.5MHZ 8SOIC; Manufacturer: Analog Devices Inc.; Amplifier Type: General Purpose; Number of Circuits: 2; Slew Rate: 12 V/µs; Current - Input Bias: 30nA; Voltage - Input Offset: 200µV; Current - Supply: 1.8mA; Current - Output / Channel: 40mA; Voltage - Supply, Single/Dual (±): ±4.5 V ~ 18 V; Supplier 1: Digi-Key; RoHS: RoHS Compliant; Category: Integrated Circuits (ICs); Stock 1: 11196; Pricing 1: 1=2.28, 10=2.05, 100=1.6441, 500=1.35136 (USD); Packaging: Cut Tape (CT); Part Status: Active; Output Type: -; Gain Bandwidth Product: 6.5MHz; -3db Bandwidth: -; Operating Temperature: -40°C ~ 125°C; Mounting Type: Surface Mount; Package / Case: 8-SOIC (0.154", 3.90mm Width); Supplier Device Package: 8-SOIC; ComponentLink1URL: http://www.analog.com/media/en/technical-documentation/data-sheets/ADA4075-2.pdf; ComponentLink1Description: http://www.analog.com/media/en/technical-documentation/data-sheets/ADA4075-2.pdf; Supplier Part Number 1: ADA4075-2ARZ-R7CT-ND; Manufacturer Part Number: ADA4075-2ARZ-R7

## Sheet Audio_Input_Mic_Array.SchDoc: MEMS Microphone Array
size 279 x 215 mm; DrawnBy: Connor Dack; Engineer: Connor Dack; DocumentNumber: 15; Revision: 1.0; SheetNumber: 15; SheetTotal: 20
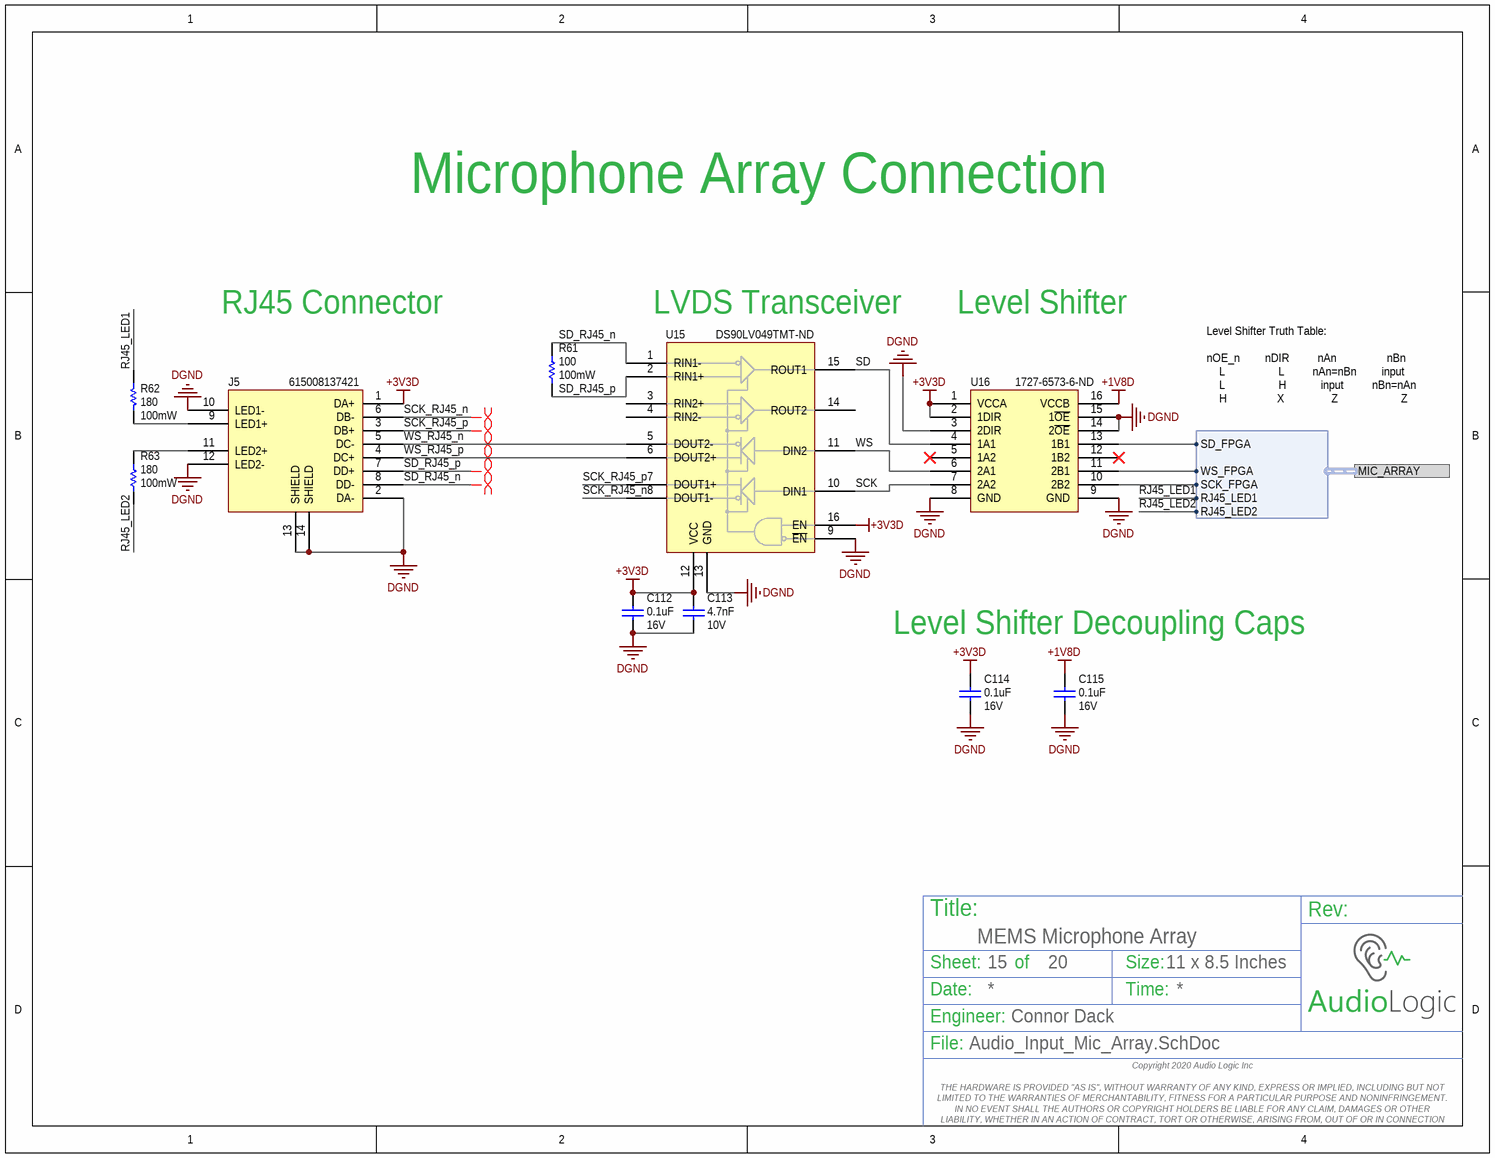
[diagram p10: Audio_Input_Mic_Array.SchDoc]

### Parts
C112  Voltage Rating: 16V  Capacitance: 0.1uF  [3-0603_L]  (hidden comment: CL10F104ZO8NNNC)
C113  Voltage Rating: 10V  Capacitance: 4.7nF  [3-0603_L]  (hidden comment: C0603C472K8RACTU)
C114  Voltage Rating: 16V  Capacitance: 0.1uF  [3-0603_L]  (hidden comment: CL10F104ZO8NNNC)
C115  Voltage Rating: 16V  Capacitance: 0.1uF  [3-0603_L]  (hidden comment: CL10F104ZO8NNNC)
J5  CONN MOD JACK 8P8C R/A SHIELDED  [RJ45]  (value not drawn)
R61  Power Rating: 100mW  Resistance: 100  [3-0603_R_L]  (hidden comment: ERA-3AEB101V)
R62  Power Rating: 100mW  Resistance: 180  [3-0603_R_L]  (hidden comment: ERA-3AEB181V)
R63  Power Rating: 100mW  Resistance: 180  [3-0603_R_L]  (hidden comment: ERA-3AEB181V)
U15  Supplier Part Number 1: DS90LV049TMT-ND  [TSOP65P640X120-16N]  (hidden comment: DS90LV049TMT)
U16  Supplier Part Number 1: 1727-6573-6-ND  [TSOP65P640X120-16N]  (hidden comment: IC TXRX 4BIT DUAL 3ST 16TSSOP)

### Ports
MIC_ARRAY (harness Microphone Array)

### Harnesses
Microphone Array: SD_FPGA, SCK_FPGA, WS_FPGA, RJ45_LED1, RJ45_LED2

### Nets
+1V8D: C115.1 U16.16(VCCB)
+3V3D: C112.1 C113.2 C114.1 J5.1(DA+) U15.12(VCC) U15.16(EN) U16.1(VCCA) U16.2(1DIR)
DGND: C112.2 C113.1 C114.2 C115.2 J5.2(DA-) J5.10(LED1-) J5.12(LED2-) J5.13(SHIELD) J5.14(SHIELD) U15.9(~{EN}) U15.13(GND) U16.3(2DIR) U16.8(GND) U16.9(GND) U16.14(2~{OE}) U16.15(1~{OE})  [project net AGND]
RJ45_LED1: R62.1 ; port MIC_ARRAY.RJ45_LED1
RJ45_LED2: R63.1 ; port MIC_ARRAY.RJ45_LED2
SCK: U15.10(DIN1) U16.7(2A2)
SCK_RJ45_n: J5.6(DB-) U15.8(DOUT1-)
SCK_RJ45_p: J5.3(DB+) U15.7(DOUT1+)
SD: U15.15(ROUT1) U16.4(1A1)
SD_RJ45_n: J5.8(DD-) R61.2 U15.1(RIN1-)
SD_RJ45_p: J5.7(DD+) R61.1 U15.2(RIN1+)
WS: U15.11(DIN2) U16.6(2A1)
WS_RJ45_n: J5.5(DC-) U15.5(DOUT2-)
WS_RJ45_p: J5.4(DC+) U15.6(DOUT2+)
NetJ1_H32: U16.11(2B1) ; port MIC_ARRAY.WS_FPGA
NetJ1_H34: U16.13(1B1) ; port MIC_ARRAY.SD_FPGA
NetJ1_H38: U16.10(2B2) ; port MIC_ARRAY.SCK_FPGA
NetJ5_9: J5.9(LED1+) R62.2
NetJ5_11: J5.11(LED2+) R63.2

Not connected (* = marked no-connect by the designer): U15 3(RIN2+) 4(RIN2-) 14(ROUT2); U16 5(1A2)* 12(1B2)*

### Layout directives
differential pair: SCK_RJ45_n, SCK_RJ45_p, SD_RJ45_n, SD_RJ45_p, WS_RJ45_n, WS_RJ45_p

### Notes on the sheet
- Microphone Array Connection
- RJ45 Connector
- (near U15) LVDS Transceiver
- Level Shifter
- Level Shifter Truth Table:
  nOE_n        nDIR         nAn                nBn
  L                 L         nAn=nBn        input
  L                 H           input         nBn=nAn
  H                X               Z                    Z
- Level Shifter Decoupling Caps
- Title:
- Sheet:
- of
- Size:
- 11 x 8.5 Inches
- Rev:
- Date:
- Engineer:
- Time:
- File:
- Copyright 2020 Audio Logic Inc
  THE HARDWARE IS PROVIDED "AS IS", WITHOUT WARRANTY OF ANY KIND, EXPRESS OR IMPLIED, INCLUDING BUT NOT LIMITED TO THE WARRANTIES OF MERCHANTABILITY, FITNESS FOR A PARTICULAR PURPOSE AND NONINFRINGEMENT. IN NO EVENT SHALL THE AUTHORS OR COPYRIGHT HOLDERS BE LIABLE FOR ANY CLAIM, DAMAGES OR OTHER LIABILITY, WHETHER IN AN ACTION OF CONTRACT, TORT OR OTHERWISE, ARISING FROM, OUT OF OR IN CONNECTION WITH THE HARDWARE OR THE USE OR OTHER DEALINGS IN THE HARDWARE.

### Library data of the parts
C112 C114 C115 = CL10F104ZO8NNNC: as C69 on sheet Audio_Input_Mic_In; Supplier 1: Digi-Key; Stock 1: 40000; Pricing 1: 1=0.1, 10=0.038, 100=0.0169, 500=0.01208, 1000=0.00949 (USD); Mount: Surface Mount; Case/Package: 0603; Case Code (Metric): 1608; Case Code (Imperial): 0603; Min Operating Temperature: -30°C; Max Operating Temperature: 85°C; Package Quantity: 1; Packaging: Tape and Reel; Dielectric: Y5V; Length: 1.6mm; Height: 0.8mm; Width: 0.031inch; Thickness: 0.035inch; Depth: 0.8mm; Radiation Hardening: No; ComponentLink1URL: https://datasheet.ciiva.com/25805/cl10f104zo8nnnc-25805810.pdf; ComponentLink1Description: https://datasheet.ciiva.com/25805/cl10f104zo8nnnc-25805810.pdf; ComponentLink2URL: https://datasheet.ciiva.com/16199/cl10f104zo8nnnc-16199254.pdf; ComponentLink2Description: https://datasheet.ciiva.com/16199/cl10f104zo8nnnc-16199254.pdf; Supplier Part Number 1: 1276-1258-6-ND; Manufacturer Part Number: CL10F104ZO8NNNC
C113 = C0603C472K8RACTU: CAP CER 4700PF 10V X7R 0603; Manufacturer: KEMET; Dielectric Material: Ceramic; Tolerance: 10%; Supplier 1: Digi-Key; Manufacturer Part Number: C0603C472K8RACTU; Stock 1: 15005; Pricing 1: 1=0.1, 10=0.053, 100=0.0236, 500=0.0168, 1000=0.0132 (USD); Mount: Surface Mount; Case/Package: 0603; Case Code (Metric): 1608; Case Code (Imperial): 0603; Contact Plating: Tin,Matte; Min Operating Temperature: -55°C; Max Operating Temperature: 125°C; Packaging: Tape and Reel; Package Quantity: 4000; Voltage Rating (DC): 10V; Dielectric: X7R; Termination: SMD/SMT; Length: 1.6mm; Width: 0.031inch; Thickness: 0.034inch; Depth: 0.8mm; REACH SVHC: No SVHC; ComponentLink1URL: http://www.mouser.com/ds/2/212/KEM_C1002_X7R_SMD-1102033.pdf; ComponentLink1Description: http://www.mouser.com/ds/2/212/KEM_C1002_X7R_SMD-1102033.pdf; ComponentLink2URL: http://components.arrow.com/part/dataview/3445604S8609586N7429; ComponentLink2Description: http://components.arrow.com/part/dataview/3445604S8609586N7429; ComponentLink3URL: https://search.kemet.com/component-edge/download/datasheet/C0603C472K8RACTU.pdf; ComponentLink3Description: https://search.kemet.com/component-edge/download/datasheet/C0603C472K8RACTU.pdf; ComponentLink4URL: http://capacitoredge.kemet.com/capedge2/DataSheet?pn=C0603C472K8RAC7867; ComponentLink4Description: http://capacitoredge.kemet.com/capedge2/DataSheet?pn=C0603C472K8RAC7867; Supplier Part Number 1: 399-9092-6-ND
J5 = 615008137421: Jack Modular Connector 8p8c (RJ45, Ethernet) 90° Angle (Right) Shielded, EMI Finger Cat5; Manufacturer: Wurth Electronics; Current Rating: 1.5A; Mating Cycles: 500; Gender: Female; Connector Type: RJ45,Socket,Jack; Voltage Rating (AC): 120V; Number of Positions: 8; Number of Ports: 1; Insulation Resistance: 500MR; Direction: Up; Supplier 1: Digi-Key; Stock 1: 1494; Pricing 1: 1=2.67, 10=2.621, 50=2.52, 100=2.419, 250=2.318 (USD); Mount: Through Hole,PCB; Contact Plating: Tin,Gold; Contact Material: Copper Alloy; Colour: Black,Green,Yellow; Housing Material: PBT; Min Operating Temperature: -40°C; Max Operating Temperature: 85°C; Shielding: Shielded; Packaging: Tray; Package Quantity: 60; Number of Rows: 1; Termination: Through Hole; Number of Contacts: 8; Orientation: Right Angle; Length: 13.46mm; Height: 16.93mm; Width: 16.25mm; Depth: 15.75mm; REACH SVHC: Unknown; Flammability Rating: UL94 V-0; ComponentLink1URL: https://datasheet.ciiva.com/11726/0900766b80f88673-11726176.pdf; ComponentLink1Description: https://datasheet.ciiva.com/11726/0900766b80f88673-11726176.pdf; ComponentLink2URL: https://datasheet.ciiva.com/4561/615008137421-71402-4561624.pdf; ComponentLink2Description: https://datasheet.ciiva.com/4561/615008137421-71402-4561624.pdf; ComponentLink3URL: https://datasheet.ciiva.com/686/615008137421-686729.pdf; ComponentLink3Description: https://datasheet.ciiva.com/686/615008137421-686729.pdf; ComponentLink4URL: https://datasheet.ciiva.com/6913/76606-6913951.pdf; ComponentLink4Description: https://datasheet.ciiva.com/6913/76606-6913951.pdf; ComponentLink5URL: https://datasheet.ciiva.com/48689/001088215-da-01-en-wr-com-modular-jack-615008137421-48689541.pdf; ComponentLink5Description: https://datasheet.ciiva.com/48689/001088215-da-01-en-wr-com-modular-jack-615008137421-48689541.pdf; Supplier Part Number 1: 732-2112-ND; Manufacturer Part Number: 615008137421
R61 = ERA-3AEB101V: RES SMD 100 OHM 0.1% 1/10W 0603; Manufacturer: Panasonic ECG; Voltage Rating: 75V; Temperature Coefficient: 25ppm/°C; Supplier 1: Digi-Key; Manufacturer Part Number: ERA-3AEB101V; Stock 1: 123480; Pricing 1: 1=0.35, 10=0.3, 100=0.1172, 1000=0.0491, 2500=0.045 (USD); Mount: Surface Mount; Case/Package: 0603; Number of Pins: 2; Case Code (Metric): 1608; Case Code (Imperial): 0603; Contact Plating: Tin; Min Operating Temperature: -55°C; Max Operating Temperature: 155°C; Tolerance: 0.1%; Packaging: Tape and Reel; Package Quantity: 5000; Composition: Metal Film,Thin Film; Number of Terminations: 2; Termination: SMD/SMT; Military Standard: Not; Max Power Dissipation: 100mW; Length: 1.6mm; Height: 0.45mm; Width: 0.8mm; Depth: 0.8mm; Radiation Hardening: No; REACH SVHC: No SVHC; ComponentLink1URL: https://datasheet.ciiva.com/46422/485442-46422517.pdf; ComponentLink1Description: https://datasheet.ciiva.com/46422/485442-46422517.pdf; ComponentLink2URL: https://datasheet.ciiva.com/7830/485442-7830582.pdf; ComponentLink2Description: https://datasheet.ciiva.com/7830/485442-7830582.pdf; ComponentLink3URL: https://datasheet.ciiva.com/46422/485442-46422518.pdf; ComponentLink3Description: https://datasheet.ciiva.com/46422/485442-46422518.pdf; ComponentLink4URL: https://datasheet.ciiva.com/17207/aoa0000ce26-17207959.pdf; ComponentLink4Description: https://datasheet.ciiva.com/17207/aoa0000ce26-17207959.pdf; ComponentLink5URL: https://datasheet.ciiva.com/5734/485442-5734520.pdf; ComponentLink5Description: https://datasheet.ciiva.com/5734/485442-5734520.pdf; ComponentLink6URL: https://datasheet.ciiva.com/5734/485442-5734521.pdf; ComponentLink6Description: https://datasheet.ciiva.com/5734/485442-5734521.pdf; ComponentLink7URL: https://datasheet.ciiva.com/28513/39837-28513817.pdf; ComponentLink7Description: https://datasheet.ciiva.com/28513/39837-28513817.pdf; ComponentLink8URL: https://datasheet.ciiva.com/11808/0900766b80fe20f7-11808029.pdf; ComponentLink8Description: https://datasheet.ciiva.com/11808/0900766b80fe20f7-11808029.pdf; ComponentLink9URL: https://datasheet.ciiva.com/16725/70068849-16725037.pdf; ComponentLink9Description: https://datasheet.ciiva.com/16725/70068849-16725037.pdf; ComponentLink10URL: https://datasheet.ciiva.com/45928/54aoa0000ce26-45928637.pdf; ComponentLink10Description: https://datasheet.ciiva.com/45928/54aoa0000ce26-45928637.pdf; ComponentLink11URL: https://datasheet.ciiva.com/9186/aoa0000ce26-9186735.pdf; ComponentLink11Description: https://datasheet.ciiva.com/9186/aoa0000ce26-9186735.pdf; ComponentLink12URL: https://datasheet.ciiva.com/48425/era-eng-tds-48425407.pdf; ComponentLink12Description: https://datasheet.ciiva.com/48425/era-eng-tds-48425407.pdf; ComponentLink13URL: https://datasheet.ciiva.com/29183/450355-da-01-en-widerstand-0603-era-29183658.pdf; ComponentLink13Description: https://datasheet.ciiva.com/29183/450355-da-01-en-widerstand-0603-era-29183658.pdf; Supplier Part Number 1: P100DBDKR-ND
R62 R63 = ERA-3AEB181V: RES SMD 180 OHM 0.1% 1/10W 0603; Manufacturer: Panasonic; Manufacturer Part Number: ERA3AEB181V; Voltage Rating: 75V; Temperature Coefficient: 25ppm/°C; Stock 1: 9289; Pricing 1: 1=0.35, 10=0.3, 100=0.1172, 1000=0.0491, 2500=0.045 (USD); Mount: Surface Mount; Case/Package: 0603; Number of Pins: 2; Case Code (Metric): 1608; Case Code (Imperial): 0603; Contact Plating: Tin; Min Operating Temperature: -55°C; Max Operating Temperature: 155°C; Composition: Thin Film; Tolerance: 0.1%; Packaging: Tape and Reel; Package Quantity: 1; Number of Terminations: 2; Termination: SMD/SMT; Military Standard: Not; Max Power Dissipation: 100mW; Voltage Rating (DC): 75V; Length: 1.6mm; Height: 0.45mm; Width: 0.8mm; Depth: 0.8mm; Radiation Hardening: No; REACH SVHC: No SVHC; Lead Free: Lead Free; ComponentLink1URL: https://datasheet.ciiva.com/11808/0900766b80fe20f7-11808021.pdf; ComponentLink1Description: https://datasheet.ciiva.com/11808/0900766b80fe20f7-11808021.pdf; ComponentLink2URL: https://datasheet.ciiva.com/9184/aoa0000ce26-9184902.pdf; ComponentLink2Description: https://datasheet.ciiva.com/9184/aoa0000ce26-9184902.pdf; ComponentLink3URL: https://datasheet.ciiva.com/30263/54aoa0000ce26-30263318.pdf; ComponentLink3Description: https://datasheet.ciiva.com/30263/54aoa0000ce26-30263318.pdf; ComponentLink4URL: https://datasheet.ciiva.com/5860/485442-5860503.pdf; ComponentLink4Description: https://datasheet.ciiva.com/5860/485442-5860503.pdf; ComponentLink5URL: https://datasheet.ciiva.com/48425/era-eng-tds-48425431.pdf; ComponentLink5Description: https://datasheet.ciiva.com/48425/era-eng-tds-48425431.pdf; ComponentLink6URL: https://datasheet.ciiva.com/5860/485442-5860505.pdf; ComponentLink6Description: https://datasheet.ciiva.com/5860/485442-5860505.pdf; ComponentLink7URL: https://datasheet.ciiva.com/9117/aoa0000ce26-9117390.pdf; ComponentLink7Description: https://datasheet.ciiva.com/9117/aoa0000ce26-9117390.pdf; ComponentLink8URL: https://datasheet.ciiva.com/7909/485442-7909087.pdf; ComponentLink8Description: https://datasheet.ciiva.com/7909/485442-7909087.pdf; ComponentLink9URL: https://datasheet.ciiva.com/48530/era-eng-tds-48530575.pdf; ComponentLink9Description: https://datasheet.ciiva.com/48530/era-eng-tds-48530575.pdf; ComponentLink10URL: https://datasheet.ciiva.com/29183/450425-da-01-en-widerstand-0603-era-29183672.pdf; ComponentLink10Description: https://datasheet.ciiva.com/29183/450425-da-01-en-widerstand-0603-era-29183672.pdf; Supplier 1: Digi-Key; Supplier Part Number 1: P180DBDKR-ND
U15 = DS90LV049TMT: IC LDVR/RCVR PAIR LVDS 16TSSOP; Manufacturer: TI National Semiconductor; Max Power Dissipation: 866mW; Number of Receivers: 2; Propagation Delay: 3.5ns; Max Supply Voltage: 3.6V; Min Supply Voltage: 3V; Operating Supply Voltage: 3.3V; Data Rate: 400Mbps; Max Supply Current: 35mA; Number of Channels: 4; Power Consumption: 70W; Logic Function: Transceiver; Supplier 1: Digi-Key; Manufacturer Part Number: DS90LV049TMT; Stock 1: 181; Pricing 1: 1=4.2, 10=3.77, 100=3.0888, 500=2.62944, 1000=2.2176 (USD); Mount: Surface Mount; Case/Package: TSSOP; Number of Pins: 16; Min Operating Temperature: -40°C; Max Operating Temperature: 85°C; Packaging: Rail/Tube; Package Quantity: 92; Number of Elements: 2; Number of Drivers: 2; Turn-On Delay Time: 3.5ns; Power Dissipation: 866mW; Radiation Hardening: No; REACH SVHC: No SVHC; Lead Free: Contains Lead; ComponentLink1URL: https://datasheet.ciiva.com/12262/snls159c-70565-12262450.pdf; ComponentLink1Description: https://datasheet.ciiva.com/12262/snls159c-70565-12262450.pdf; ComponentLink2URL: https://datasheet.ciiva.com/1498/1787948-1498728.pdf; ComponentLink2Description: https://datasheet.ciiva.com/1498/1787948-1498728.pdf; ComponentLink3URL: https://datasheet.ciiva.com/15133/getdatasheetpartid-646755-15133256.pdf; ComponentLink3Description: https://datasheet.ciiva.com/15133/getdatasheetpartid-646755-15133256.pdf; ComponentLink4URL: https://datasheet.ciiva.com/3151/ds90lv049-3151691.pdf; ComponentLink4Description: https://datasheet.ciiva.com/3151/ds90lv049-3151691.pdf; ComponentLink5URL: https://datasheet.ciiva.com/26832/ds90lv049tmt-26832770.pdf; ComponentLink5Description: https://datasheet.ciiva.com/26832/ds90lv049tmt-26832770.pdf
U16 = 74AVC4T245PW,118: Voltage Level Translator Bidirectional 2 Circuit 2 Channel 380Mbps 16-TSSOP; Manufacturer: NXP Semiconductors; Max Supply Voltage: 3.6V; Min Supply Voltage: 800mV; Propagation Delay: 14.7ns; Number of Channels: 4; Number of Elements: 2; Logic Function: Transceiver,Translator; Low Level Output Current: 12mA; Turn-On Delay Time: 14.5ns; Polarity: Non-Inverting; High Level Output Current: -12mA; Quiescent Current: 70uA; Supplier 1: Digi-Key; Stock 1: 22627; Pricing 1: 1=0.9, 10=0.804, 100=0.6266, 500=0.51764, 1000=0.40866 (USD); Mount: Surface Mount; Case/Package: TSSOP; Number of Pins: 16; Contact Plating: Gold; Min Operating Temperature: -40°C; Max Operating Temperature: 125°C; Packaging: Tape and Reel; Package Quantity: 2500; Data Rate: 380Mbps; Number of Bits: 4; Number of Circuits: 2; Radiation Hardening: No; Lead Free: Lead Free; ComponentLink1URL: https://datasheet.ciiva.com/1900/74avc4t245-1900214.pdf; ComponentLink1Description: https://datasheet.ciiva.com/1900/74avc4t245-1900214.pdf; ComponentLink2URL: https://datasheet.ciiva.com/1900/74avc4t245-1900215.pdf; ComponentLink2Description: https://datasheet.ciiva.com/1900/74avc4t245-1900215.pdf; ComponentLink3URL: https://datasheet.ciiva.com/1900/74avc4t245-1900216.pdf; ComponentLink3Description: https://datasheet.ciiva.com/1900/74avc4t245-1900216.pdf; ComponentLink4URL: https://datasheet.ciiva.com/15086/getdatasheetpartid-442686-15086830.pdf; ComponentLink4Description: https://datasheet.ciiva.com/15086/getdatasheetpartid-442686-15086830.pdf; Manufacturer Part Number: 74AVC4T245PW,118